# Altium project cs42448_breakout.PrjPcb
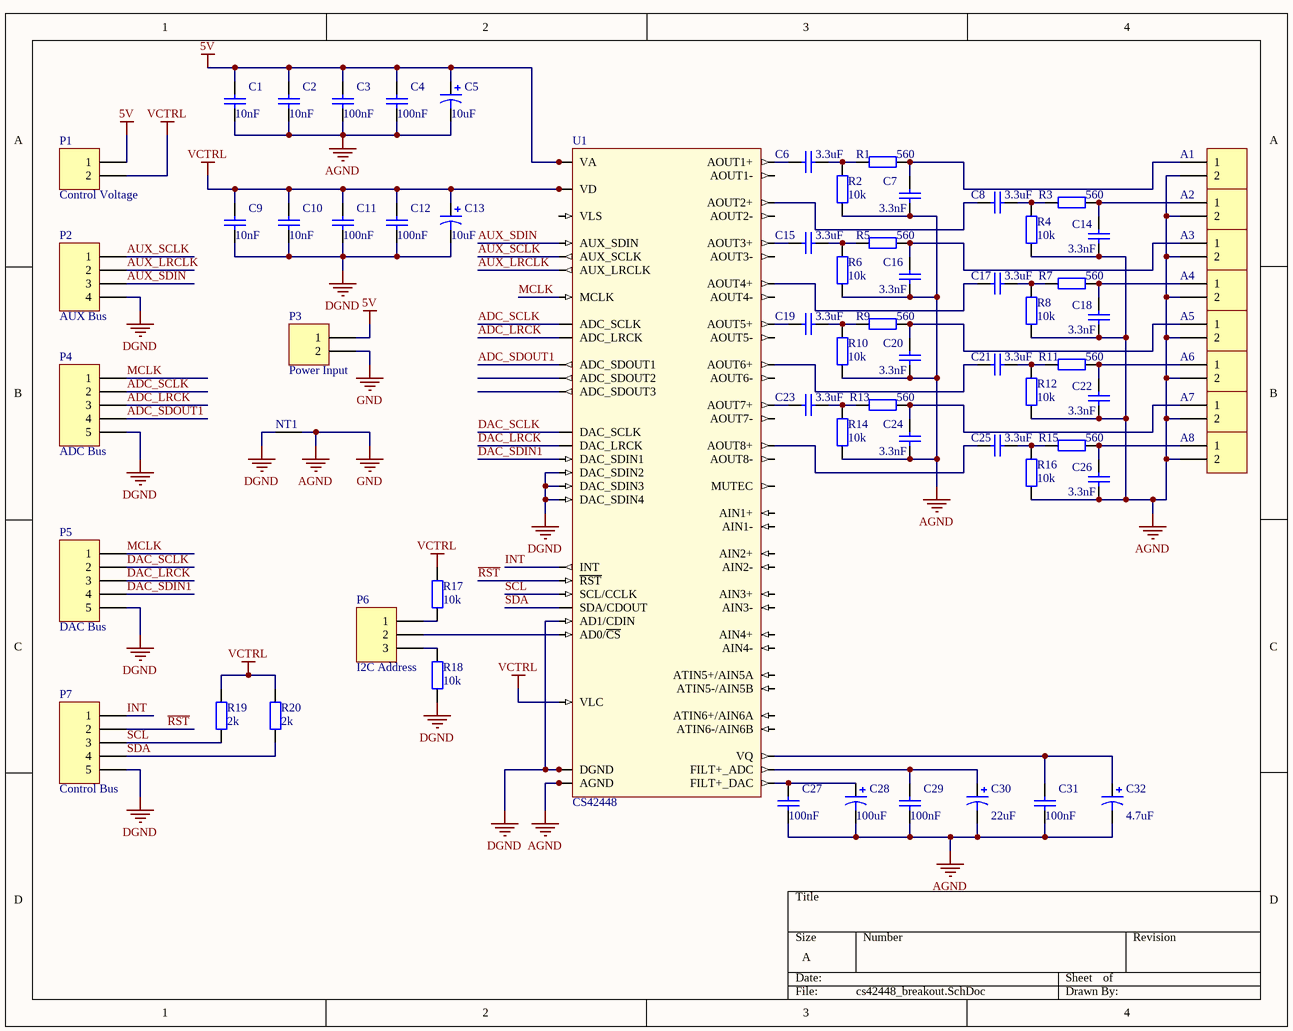
[diagram p0: cs42448_breakout.SchDoc]
1 sheet, 69 parts. Net scope: global (net labels, ports and power ports of the same name join across sheets).
Board file: cs42448_breakout.PcbDoc

## Sheet cs42448_breakout.SchDoc
size A

### Parts
A1  Header 2  [HDR1X2]  (value not drawn)
A2  Header 2  [HDR1X2]  (value not drawn)
A3  Header 2  [HDR1X2]  (value not drawn)
A4  Header 2  [HDR1X2]  (value not drawn)
A5  Header 2  [HDR1X2]  (value not drawn)
A6  Header 2  [HDR1X2]  (value not drawn)
A7  Header 2  [HDR1X2]  (value not drawn)
A8  Header 2  [HDR1X2]  (value not drawn)
C1  value 10nF  [1608[0603]]  (hidden comment: Cap)
C2  value 10nF  [1608[0603]]  (hidden comment: Cap)
C3  value 100nF  [1608[0603]]  (hidden comment: Cap)
C4  value 100nF  [1608[0603]]  (hidden comment: Cap)
C5  value 10uF  [CAPR5-4X5]  (hidden comment: Cap Pol1)
C6  value 3.3uF  [1608[0603]]  (hidden comment: Cap)
C7  value 3.3nF  [1608[0603]]  (hidden comment: Cap)
C8  value 3.3uF  [1608[0603]]  (hidden comment: Cap)
C9  value 10nF  [1608[0603]]  (hidden comment: Cap)
C10  value 10nF  [1608[0603]]  (hidden comment: Cap)
C11  value 100nF  [1608[0603]]  (hidden comment: Cap)
C12  value 100nF  [1608[0603]]  (hidden comment: Cap)
C13  value 10uF  [CAPR5-4X5]  (hidden comment: Cap Pol1)
C14  value 3.3nF  [1608[0603]]  (hidden comment: Cap)
C15  value 3.3uF  [1608[0603]]  (hidden comment: Cap)
C16  value 3.3nF  [1608[0603]]  (hidden comment: Cap)
C17  value 3.3uF  [1608[0603]]  (hidden comment: Cap)
C18  value 3.3nF  [1608[0603]]  (hidden comment: Cap)
C19  value 3.3uF  [1608[0603]]  (hidden comment: Cap)
C20  value 3.3nF  [1608[0603]]  (hidden comment: Cap)
C21  value 3.3uF  [1608[0603]]  (hidden comment: Cap)
C22  value 3.3nF  [1608[0603]]  (hidden comment: Cap)
C23  value 3.3uF  [1608[0603]]  (hidden comment: Cap)
C24  value 3.3nF  [1608[0603]]  (hidden comment: Cap)
C25  value 3.3uF  [1608[0603]]  (hidden comment: Cap)
C26  value 3.3nF  [1608[0603]]  (hidden comment: Cap)
C27  value 100nF  [1608[0603]]  (hidden comment: Cap)
C28  value 100uF  [CAPR5-4X5]  (hidden comment: Cap Pol1)
C29  value 100nF  [1608[0603]]  (hidden comment: Cap)
C30  value 22uF  [CAPR5-4X5]  (hidden comment: Cap Pol1)
C31  value 100nF  [1608[0603]]  (hidden comment: Cap)
C32  value 4.7uF  [CAPR5-4X5]  (hidden comment: Cap Pol1)
NT1  Net Tie  [1608[0603] Net Tie]  (value not drawn)  (net tie, no BOM)
P1  Control Voltage  [HDR1X2]
P2  AUX Bus  [HDR1X4]
P3  Power Input  [HDR1X2]
P4  ADC Bus  [HDR1X5]
P5  DAC Bus  [HDR1X5]
P6  I2C Address  [HDR1X3]
P7  Control Bus  [HDR1X5]
R1  value 560  [1608[0603]]  (hidden comment: Res2)
R2  value 10k  [1608[0603]]  (hidden comment: Res2)
R3  value 560  [1608[0603]]  (hidden comment: Res2)
R4  value 10k  [1608[0603]]  (hidden comment: Res2)
R5  value 560  [1608[0603]]  (hidden comment: Res2)
R6  value 10k  [1608[0603]]  (hidden comment: Res2)
R7  value 560  [1608[0603]]  (hidden comment: Res2)
R8  value 10k  [1608[0603]]  (hidden comment: Res2)
R9  value 560  [1608[0603]]  (hidden comment: Res2)
R10  value 10k  [1608[0603]]  (hidden comment: Res2)
R11  value 560  [1608[0603]]  (hidden comment: Res2)
R12  value 10k  [1608[0603]]  (hidden comment: Res2)
R13  value 560  [1608[0603]]  (hidden comment: Res2)
R14  value 10k  [1608[0603]]  (hidden comment: Res2)
R15  value 560  [1608[0603]]  (hidden comment: Res2)
R16  value 10k  [1608[0603]]  (hidden comment: Res2)
R17  value 10k  [1608[0603]]  (hidden comment: Res2)
R18  value 10k  [1608[0603]]  (hidden comment: Res2)
R19  value 2k  [1608[0603]]  (hidden comment: Res2)
R20  value 2k  [1608[0603]]  (hidden comment: Res2)
U1  CS42448  [64L-LQFP]

### Nets
5V: C1.2 C2.2 C3.2 C4.2 C5.1 P1.1 P3.1 U1.44(VA) U1.53(VA)
AGND: A1.2 A2.2 A3.2 A4.2 A5.2 A6.2 A7.2 A8.2 C1.1 C2.1 C3.1 C4.1 C5.2 C7.1 C14.1 C16.1 C18.1 C20.1 C22.1 C24.1 C26.1 C27.1 C28.2 C29.1 C30.2 C31.1 C32.2 NT1.2 P3.2 R2.2 R4.2 R6.2 R8.2 R10.2 R12.2 R14.2 R16.2 U1.42(AGND) U1.56(AGND)  [also labelled GND]
DGND: C9.1 C10.1 C11.1 C12.1 C13.2 NT1.1 P2.4 P4.5 P5.5 P7.5 R18.2 U1.2(AD1/CDIN) U1.7(DGND) U1.14(DAC_SDIN4) U1.15(DAC_SDIN3) U1.16(DAC_SDIN2) U1.23(DGND) U1.62(DGND)
VCTRL: C9.2 C10.2 C11.2 C12.2 C13.1 P1.2 R17.1 R19.1 R20.1 U1.4(VLC) U1.6(VD) U1.24(VD)
ADC_LRCK: P4.3 U1.5(ADC_LRCK)
ADC_SCLK: P4.2 U1.9(ADC_SCLK)
ADC_SDOUT1: P4.4 U1.13(ADC_SDOUT1)
AUX_LRCLK: P2.2 U1.20(AUX_LRCLK)
AUX_SCLK: P2.1 U1.21(AUX_SCLK)
AUX_SDIN: P2.3 U1.22(AUX_SDIN)
DAC_LRCK: P5.3 U1.19(DAC_LRCK)
DAC_SCLK: P5.2 U1.18(DAC_SCLK)
DAC_SDIN1: P5.4 U1.17(DAC_SDIN1)
INT: P7.1 U1.61(INT)
MCLK: P4.1 P5.1 U1.10(MCLK)
~{RST}: P7.2 U1.3(~{RST})
SCL: P7.3 R19.2 U1.63(SCL/CCLK)
SDA: P7.4 R20.2 U1.64(SDA/CDOUT)
NetA1_1: A1.1 C7.2 R1.1
NetA2_1: A2.1 C14.2 R3.1
NetA3_1: A3.1 C16.2 R5.1
NetA4_1: A4.1 C18.2 R7.1
NetA5_1: A5.1 C20.2 R9.1
NetA6_1: A6.1 C22.2 R11.1
NetA7_1: A7.1 C24.2 R13.1
NetA8_1: A8.1 C26.2 R15.1
NetC6_1: C6.1 R1.2 R2.1
NetC6_2: C6.2 U1.26(AOUT1+)
NetC8_1: C8.1 R3.2 R4.1
NetC8_2: C8.2 U1.27(AOUT2+)
NetC15_1: C15.1 R5.2 R6.1
NetC15_2: C15.2 U1.30(AOUT3+)
NetC17_1: C17.1 R7.2 R8.1
NetC17_2: C17.2 U1.31(AOUT4+)
NetC19_1: C19.1 R9.2 R10.1
NetC19_2: C19.2 U1.34(AOUT5+)
NetC21_1: C21.1 R11.2 R12.1
NetC21_2: C21.2 U1.36(AOUT6+)
NetC23_1: C23.1 R13.2 R14.1
NetC23_2: C23.2 U1.39(AOUT7+)
NetC25_1: C25.1 R15.2 R16.1
NetC25_2: C25.2 U1.40(AOUT8+)
NetC27_2: C27.2 C28.1 U1.54(FILT+_DAC)
NetC29_2: C29.2 C30.1 U1.55(FILT+_ADC)
NetC31_2: C31.2 C32.1 U1.43(VQ)
NetP6_1: P6.1 R17.2
NetP6_2: P6.2 U1.1(AD0/~{CS})
NetP6_3: P6.3 R18.1

Not connected (* = marked no-connect by the designer): U1 8(VLS) 11(ADC_SDOUT3) 12(ADC_SDOUT2) 25(AOUT1-) 28(AOUT2-) 29(AOUT3-) 32(AOUT4-) 33(AOUT5-) 35(MUTEC) 37(AOUT6-) 38(AOUT7-) 41(AOUT8-) 45(AIN1-) 46(AIN1+) 47(AIN2-) 48(AIN2+) 49(AIN3-) 50(AIN3+) 51(AIN4-) 52(AIN4+) 57(ATIN5-/AIN5B) 58(ATIN5+/AIN5A) 59(ATIN6-/AIN6B) 60(ATIN6+/AIN6A)

### Library data of the parts
A1-A8 P1 P3 = Header 2: Header, 2-Pin; LatestRevisionDate: 17-Jul-2002; LatestRevisionNote: Re-released for DXP Platform.; Publisher: Altium Limited
C1-C4 C6-C12 C14-C27 C29 C31 = Cap: Capacitor; Published: 8-Jun-2000; LatestRevisionDate: 17-Jul-2002; LatestRevisionNote: Re-released for DXP Platform.; PackageReference: RAD-0.3; Publisher: Altium Limited; PackageDescription: Radial Cap, Thru-Hole; 2 Leads; 0.3 in Pin Spacing
  C1 C2 C9 C10: element14: 2496828
  C3 C4 C11 C12 C27 C29 C31: element14: 2320793
  C6 C8 C15 C17 C19 C21 C23 C25: element14: 1108324
  C7 C14 C16 C18 C20 C22 C24 C26: element14: 1759029
C5 C13 C28 C30 C32 = Cap Pol1: Polarized Capacitor (Radial); Published: 8-Jun-2000; LatestRevisionDate: 17-Jul-2002; LatestRevisionNote: Re-released for DXP Platform.; PackageReference: RB7.6-15; Publisher: Altium Limited; PackageDescription: Polarized Capacitor (Radial); 2 Leads
P2 = Header 4: Header, 4-Pin; LatestRevisionDate: 17-Jul-2002; LatestRevisionNote: Re-released for DXP Platform.; Publisher: Altium Limited
P4 P5 P7 = Header 5: Header, 5-Pin; LatestRevisionDate: 17-Jul-2002; LatestRevisionNote: Re-released for DXP Platform.; Publisher: Altium Limited
P6 = Header 3: Header, 3-Pin; LatestRevisionDate: 17-Jul-2002; LatestRevisionNote: Re-released for DXP Platform.; Publisher: Altium Limited
R1-R20 = Res2: Resistor; Published: 8-Jun-2000; LatestRevisionDate: 17-Jul-2002; LatestRevisionNote: Re-released for DXP Platform.; PackageReference: AXIAL-0.4; Publisher: Altium Limited; PackageDescription: Axial Device, Thru-Hole; 2 Leads; 0.4 in Pin Spacing
U1 = CS42448: 108 dB, 192 kHz 6-In, 8-Out CODEC